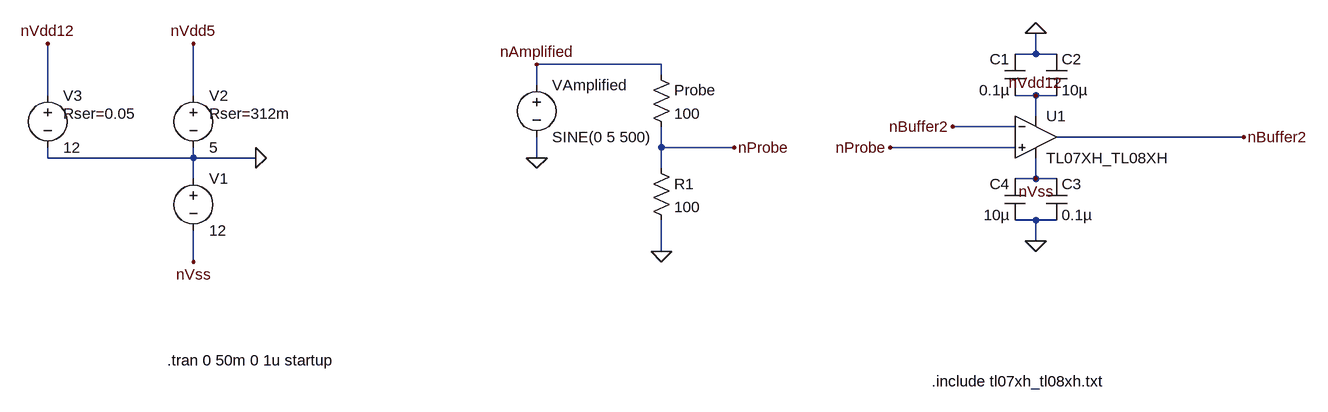
[diagram p0: schematic Stage4Probe_Buffer.asc]
Stage4Probe_Buffer.asc, the LTspice schematic file:
Version 4
SHEET 1 1912 680
WIRE 1472 -80 1472 -112
WIRE 1472 -80 1440 -80
WIRE 1504 -80 1472 -80
WIRE 896 -64 704 -64
WIRE 896 -48 896 -64
WIRE 704 -32 704 -64
WIRE -48 -16 -48 -96
WIRE 176 -16 176 -96
WIRE 1472 -16 1440 -16
WIRE 1504 -16 1472 -16
WIRE 1472 16 1472 -16
WIRE 1440 32 1344 32
WIRE 1792 48 1504 48
WIRE 896 64 896 32
WIRE 1008 64 896 64
WIRE 1440 64 1248 64
WIRE -48 80 -48 64
WIRE 176 80 176 64
WIRE 176 80 -48 80
WIRE 272 80 176 80
WIRE 704 80 704 48
WIRE 896 96 896 64
WIRE 176 112 176 80
WIRE 1472 112 1472 80
WIRE 1472 112 1440 112
WIRE 1504 112 1472 112
WIRE 1472 176 1440 176
WIRE 1504 176 1472 176
WIRE 1472 208 1472 176
WIRE 896 224 896 176
WIRE 176 240 176 192
FLAG 272 80 0
FLAG 176 240 nVss
FLAG 176 -96 nVdd5
FLAG -48 -96 nVdd12
FLAG 704 -64 nAmplified
FLAG 896 224 0
FLAG 1008 64 nProbe
FLAG 1472 -16 nVdd12
FLAG 1472 112 nVss
FLAG 1248 64 nProbe
FLAG 1344 32 nBuffer2
FLAG 1792 48 nBuffer2
FLAG 1472 -112 0
FLAG 1472 208 0
FLAG 704 80 0
SYMBOL voltage 176 96 R0
WINDOW 123 0 0 Left 0
WINDOW 39 0 0 Left 0
SYMATTR InstName V1
SYMATTR Value 12
SYMBOL voltage 176 -32 R0
WINDOW 123 0 0 Left 0
WINDOW 39 24 44 Left 2
SYMATTR SpiceLine Rser=312m
SYMATTR InstName V2
SYMATTR Value 5
SYMBOL voltage -48 -32 R0
WINDOW 123 0 0 Left 0
WINDOW 39 24 44 Left 2
SYMATTR SpiceLine Rser=0.05
SYMATTR InstName V3
SYMATTR Value 12
SYMBOL res 880 80 R0
SYMATTR InstName R1
SYMATTR Value 100
SYMATTR SpiceLine tol=1 pwr=0.5
SYMBOL res 880 -64 R0
SYMATTR InstName Probe
SYMATTR Value 100
SYMBOL OpAmps\\opamp2 1472 -16 R0
SYMATTR InstName U1
SYMATTR Value TL07XH_TL08XH
SYMBOL cap 1456 -16 R180
WINDOW 0 24 56 Left 2
WINDOW 3 24 8 Left 2
SYMATTR InstName C1
SYMATTR Value 0.1µ
SYMATTR SpiceLine V=16 Irms=0.6 Rser=0.05
SYMBOL cap 1488 -80 R0
SYMATTR InstName C2
SYMATTR Value 10µ
SYMATTR SpiceLine V=10 Irms=1.25 Rser=5m
SYMBOL cap 1488 112 R0
SYMATTR InstName C3
SYMATTR Value 0.1µ
SYMATTR SpiceLine V=16 Irms=0.6 Rser=0.05
SYMBOL cap 1456 176 R180
WINDOW 0 24 56 Left 2
WINDOW 3 24 8 Left 2
SYMATTR InstName C4
SYMATTR Value 10µ
SYMATTR SpiceLine V=10 Irms=1.25 Rser=5m
SYMBOL voltage 704 -48 R0
WINDOW 123 0 0 Left 0
WINDOW 39 0 0 Left 0
SYMATTR InstName VAmplified
SYMATTR Value SINE(0 5 500)
TEXT 136 392 Left 2 !.tran 0 50m 0 1u startup
TEXT 1312 424 Left 2 !.include tl07xh_tl08xh.txt

The netlist it stands for:
* Stage4Probe_Buffer.asc
V1 0 nVss 12
V2 nVdd5 0 5 Rser=312m
V3 nVdd12 0 12 Rser=0.05
R1 nProbe 0 100 tol=1 pwr=0.5
R§Probe nAmplified nProbe 100
XU1 nProbe nBuffer2 nVdd12 nVss nBuffer2 TL07XH_TL08XH  ; pins In+ In- V+ V- OUT
C1 nVdd12 0 0.1µ V=16 Irms=0.6 Rser=0.05
C2 0 nVdd12 10µ V=10 Irms=1.25 Rser=5m
C3 nVss 0 0.1µ V=16 Irms=0.6 Rser=0.05
C4 0 nVss 10µ V=10 Irms=1.25 Rser=5m
VAmplified nAmplified 0 SINE(0 5 500)
.tran 0 50m 0 1u startup
.include tl07xh_tl08xh.txt
.backanno
.end